# EAGLE design TL431_OverVoltProt (EAGLE 7.6.0)
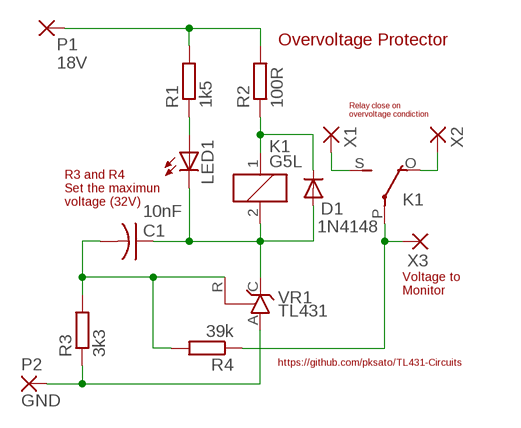
[diagram p0: schematic, sheet 1]

## Parts
C1  10nF  C-US050-024X044  [C050-024X044]
D1  1N4148  DIODE-D-5  [D-5]
K1  G5L  [G5LE]
LED1  LED5MM  [LED5MM]
P1  18V  WIREPAD2,54/1,0  [2,54/1,0]
P2  GND  WIREPAD2,54/1,0  [2,54/1,0]
R1  1k5  R-EU_0207/10  [0207/10]
R2  100R  R-EU_0207/10  [0207/10]
R3  3k3  R-EU_0207/10  [0207/10]
R4  39k  R-EU_0207/10  [0207/10]
VR1  TL431  TL431CLP  [TO92-CLP]
X1  WIREPAD2,54/1,0  [2,54/1,0]
X2  WIREPAD2,54/1,0  [2,54/1,0]
X3  WIREPAD2,54/1,0  [2,54/1,0]

## Nets
N$1: K1.S(2:S) X1.1(P)
N$2: K1.O(2:O) X2.1(P)
N$3: K1.P(2:P) R4.1 X3.1(P)
N$4: D1.C K1.1 R2.1
N$5: C1.1 D1.A K1.2 LED1.K(C) VR1.C
N$7: LED1.A R1.1
N$8: C1.2 R3.2 R4.2 VR1.R
N$10: P2.1(P) R3.1 VR1.A
N$11: P1.1(P) R1.2 R2.2

## Notes on the sheet
- Overvoltage Protector
- Relay close on
  overvoltage condiction
- R3 and R4
  Set the maximun
  voltage (32V)
- Voltage to
  Monitor
- https://github.com/pksato/TL431-Circuits

## Library data of the parts
C1 = rcl:C-US: CAPACITOR, American symbol
D1 = diode:DIODE-: DIODE
K1 = relay:G5L: RELAY 1 x switch, 10 A/120 V AC, 8 A/30 V ADC, Omron; OC_FARNELL: unknown; OC_NEWARK: unknown
LED1 = led:LED: LED OSRAM: - CHIPLED LG R971, LG N971, LY N971, LG Q971, LY Q971, LO R971, LY R971 LH N974, LH R974 LS Q976, LO Q976, LY Q976 LO Q996 - Hyper CHIPLED LW Q18S LB Q993, LB Q99A, LB R99A - SideLED LS A670, LO A670, LY A670, LG A670, LP A670 LB A673, LV A673, LT A673, LW A673 LH A674 LY A675 LS A676, LA A676, LO A676, LY A676, LW A676 LS A679, LY A679, LG A679 - Hyper Micro SIDELED® LS Y876, LA Y876, LO Y876, LY Y876 LT Y87S - SmartLED LW L88C, LW L88S LB L89C, LB L89S, LG L890 LS L89K, LO L89K, LY L89K LS L896, LA L896, LO L896, LY L896 - TOPLED LS T670, LO T670, LY T670, LG T670, LP T670 LSG T670, LSP T670, LSY T670, LOP T670, LYG T670 LG T671, LOG T671, LSG T671 LB T673, LV T673, LT T673, LW T673 LH T674 LS T676, LA T676, LO T676, LY T676, LB T676, LH T676, LSB T676, LW T676 LB T67C, LV T67C, LT T67C, LS T67K, LO T67K, LY T67K, LW E67C LS E67B, LA E67B, LO E67B, LY E67B, LB E67C, LV E67C, LT E67C LW T67C LS T679, LY T679, LG T679 LS T770, LO T770, LY T770, LG T770, LP T770 LB T773, LV T773, LT T773, LW T773 LH T774 LS E675, LA E675, LY E675, LS T675 LS T776, LA T776, LO T776, LY T776, LB T776 LHGB T686 LT T68C, LB T68C - Hyper Mini TOPLED® LB M676 - Mini TOPLED Santana® LG M470 LS M47K, LO M47K, LY M47K Source: http://www.osram.convergy.de LUXEON: - LUMILED® LXK2-PW12-R00, LXK2-PW12-S00, LXK2-PW14-U00, LXK2-PW14-V00 LXK2-PM12-R00, LXK2-PM12-S00, LXK2-PM14-U00 LXK2-PE12-Q00, LXK2-PE12-R00, LXK2-PE12-S00, LXK2-PE14-T00, LXK2-PE14-U00 LXK2-PB12-K00, LXK2-PB12-L00, LXK2-PB12-M00, LXK2-PB14-N00, LXK2-PB14-P00, LXK2-PB14-Q00 LXK2-PR12-L00, LXK2-PR12-M00, LXK2-PR14-Q00, LXK2-PR14-R00 LXK2-PD12-Q00, LXK2-PD12-R00, LXK2-PD12-S00 LXK2-PH12-R00, LXK2-PH12-S00 LXK2-PL12-P00, LXK2-PL12-Q00, LXK2-PL12-R00 Source: www.luxeon.com KINGBRIGHT: KA-3528ASYC Source: www.kingbright.com
P1 P2 X1-X3 = wirepad:WIREPAD: Wire PAD connect wire on PCB
R1-R4 = rcl:R-EU_: RESISTOR, European symbol
VR1 = v-reg:TL431CLP: VOLTAGE REGULATOR

## Board
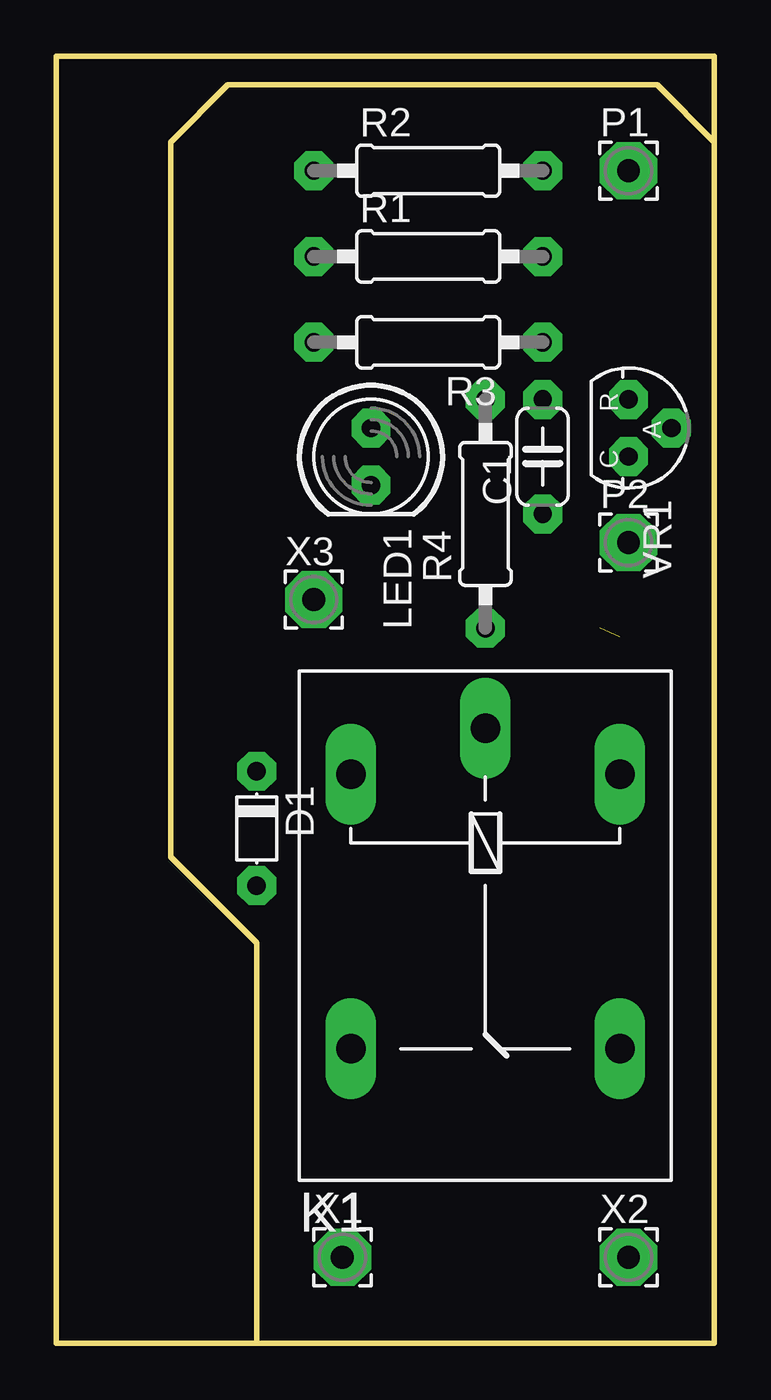
[diagram p1: board, top side]
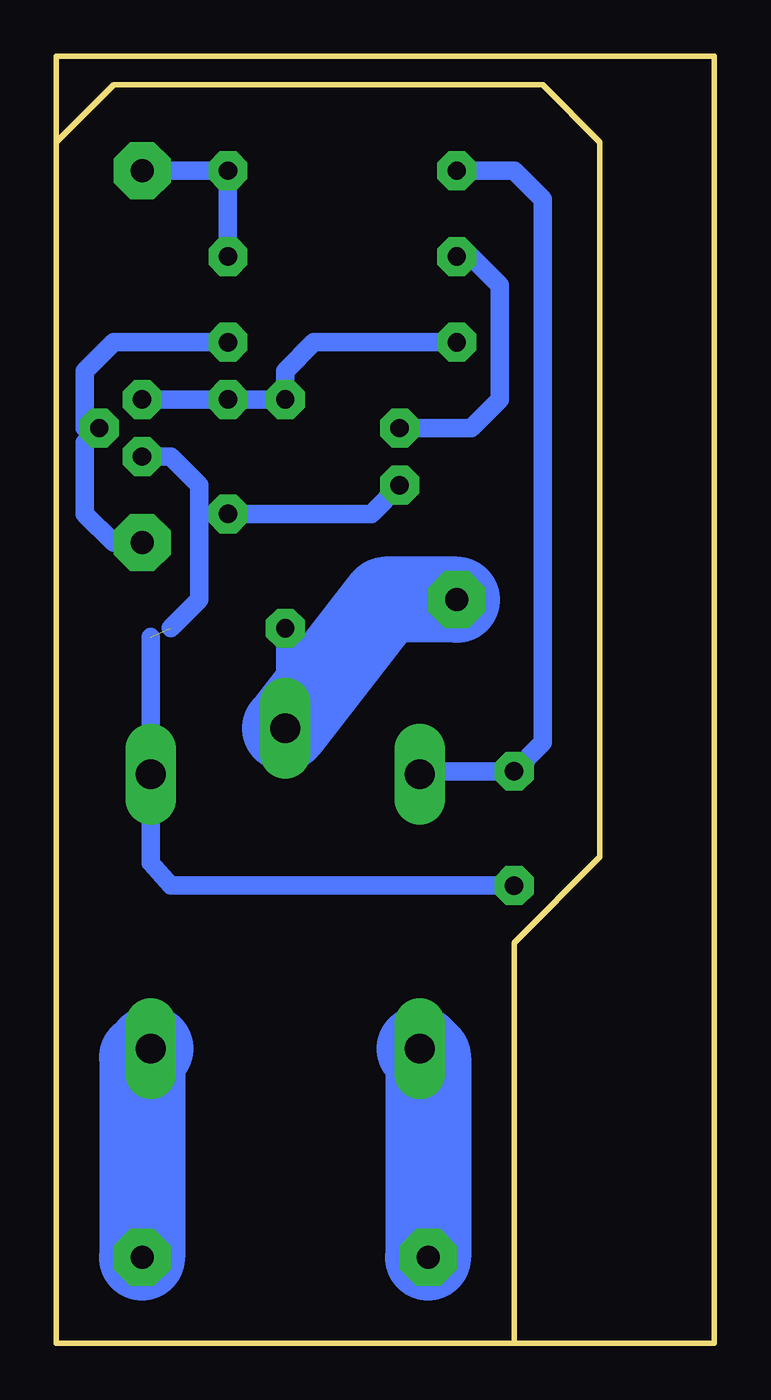
[diagram p2: board, bottom side, seen from below]

Size 29.21 x 57.15 mm. Coordinates in mm from the lower left corner, seen from the top.
Outline: 29.21,57.14 29.21,0 0,0 0,57.15 29.21,57.15
Copper layers (1*16): Top 0.035mm / dielectric 1.5mm / Bottom 0.035mm
Design rules "default *": minimum track width 10mil, minimum drill 24mil, track to track 8mil, track to pad 8mil, pad to pad 8mil, via to via 8mil, smd to smd 8mil, copper to edge 40mil, drill to drill 8mil, minimum pad ring 18mil, minimum via ring 8mil, stop-mask expansion 4mil, vias tented up to drill 0mil, thermal gap 10mil

### Footprints (pad centres in the part's own frame; a part is rotated, then mirrored left to right if it is on the bottom)
C050-024X044 = drill 0.813 octagon: 1 -2.54,0; 2 2.54,0
D-5 = drill 0.813 octagon: A 2.54,0; C -2.54,0
G5LE = drill 1.321 long: 1 -7.493,-5.969; 2 -7.493,5.969; O 4.699,5.969; P -9.525,0; S 4.699,-5.969
LED5MM = drill 0.813 octagon: A -1.27,0; K 1.27,0
2,54/1,0 = drill 1.016 pad 2.54 octagon: 1 0,0
0207/10 = drill 0.813 octagon: 1 -5.08,0; 2 5.08,0
TO92-CLP = drill 0.813 octagon: A 0,1.905; C 1.27,0; R -1.27,0

### Placement (x,y rotation side)
C1  21.59,39.37 90 top
D1  8.89,22.86 270 top
K1  19.05,17.78 270 top
LED1  13.97,39.37 270 top
P1  25.4,52.07 0 top
P2  25.4,35.56 0 top
R1  16.51,48.26 0 top
R2  16.51,52.07 0 top
R3  16.51,44.45 180 top
R4  19.05,36.83 90 top
VR1  25.4,40.64 270 top
X1  12.7,3.81 0 top
X2  25.4,3.81 0 top
X3  11.43,33.02 0 top

### Tracks (layer width: path | path; a pad name or v marks a point on that pad's centre or on a via)
N$1
  Bottom 3.81: K1.S 12.7,12.7 X1.1
N$2
  Bottom 3.81: K1.O 25.4,12.7 X2.1
N$3
  Bottom 0.813: R4.1 K1.P
  Bottom 3.81: X3.1 14.61,33.02 K1.P
N$4
  Bottom 0.61: 12.7,25.4 12.83,25.27
  Bottom 0.813: R2.1 8.89,52.07 7.62,50.8 7.62,26.67 D1.C 12.7,25.4 | 12.83,25.27 K1.1
N$5  (1 unrouted)
  Bottom 0.61: C1.1 22.86,36.83
  Bottom 0.813: 24.13,31.75 22.86,33.02 22.86,36.83 22.86,38.1 24.13,39.37 VR1.C | D1.A 24.13,20.32 25.02,21.34 K1.2 25.02,31.37 | LED1.K 15.24,36.83 C1.1
N$7
  Bottom 0.813: R1.1 10.79,48.26 9.53,46.99 9.53,41.91 10.79,40.64 LED1.A
N$8
  Bottom 0.813: VR1.R C1.2 R4.2 19.05,43.18 17.78,44.45 R3.2
N$10
  Bottom 0.813: P2.1 26.67,35.56 27.94,36.83 27.94,40.01 VR1.A 27.94,40.64 27.94,43.18 26.67,44.45 R3.1
N$11
  Bottom 0.813: R1.2 R2.2 P1.1